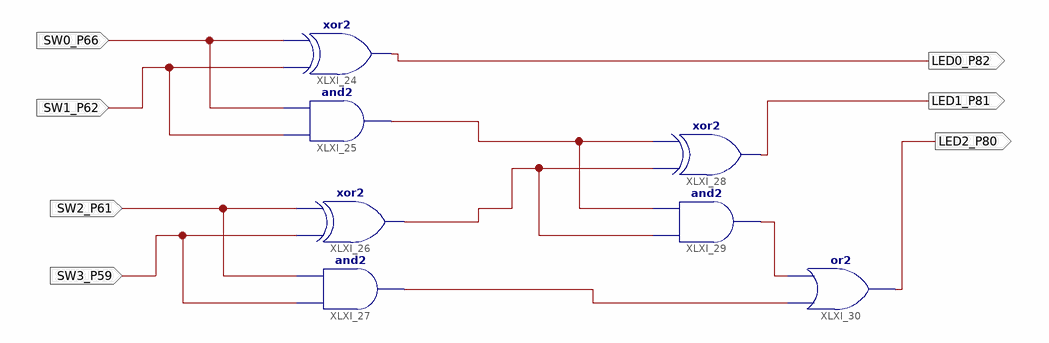
[diagram p0: schematic sheet 1]
// Xilinx ISE schematic calculate.sch (spartan6) as structural Verilog: 7 symbols, 7 ports
module calculate (
  input  SW0_P66,
  input  SW1_P62,
  input  SW2_P61,
  input  SW3_P59,
  output LED0_P82,
  output LED1_P81,
  output LED2_P80
);

  wire XLXN_78, XLXN_79, XLXN_81, XLXN_82;

  xor XLXI_24 (LED0_P82, SW1_P62, SW0_P66);
  and XLXI_25 (XLXN_78, SW1_P62, SW0_P66);
  xor XLXI_26 (XLXN_79, SW3_P59, SW2_P61);
  and XLXI_27 (XLXN_81, SW3_P59, SW2_P61);
  xor XLXI_28 (LED1_P81, XLXN_79, XLXN_78);
  and XLXI_29 (XLXN_82, XLXN_79, XLXN_78);
  or XLXI_30 (LED2_P80, XLXN_81, XLXN_82);
endmodule
